# EAGLE schematic MISSION_FM1 (EAGLE 5.10)
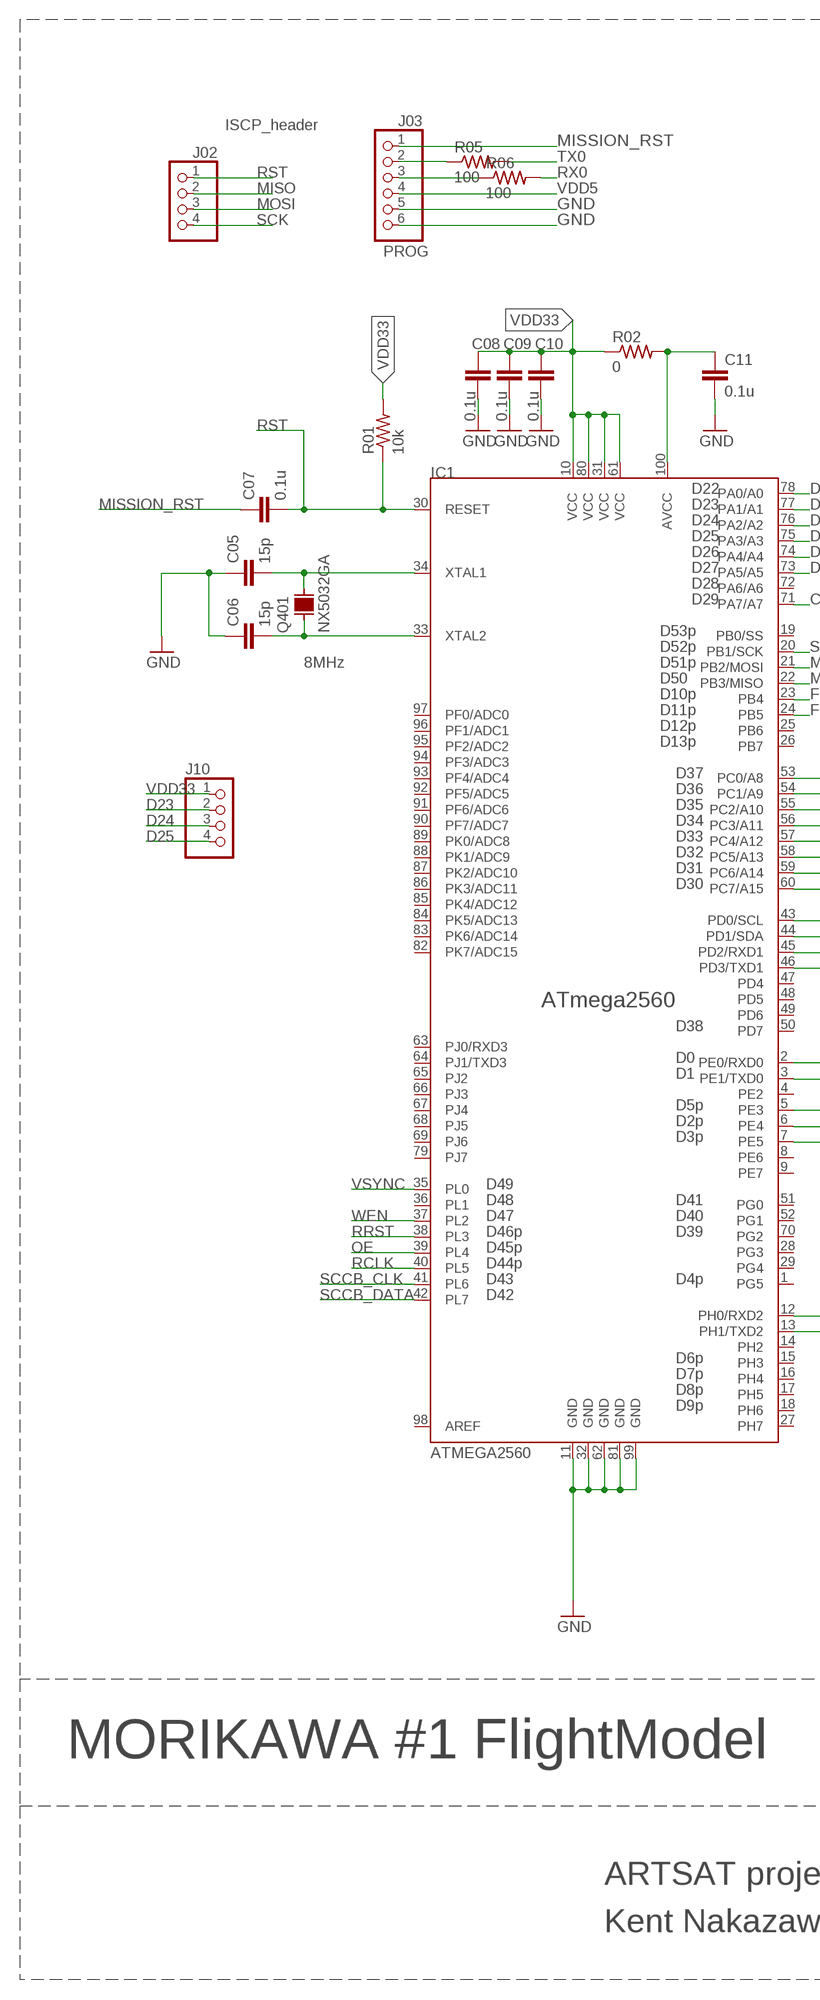
[diagram p0: schematic, sheet 1, part 1 of 2]
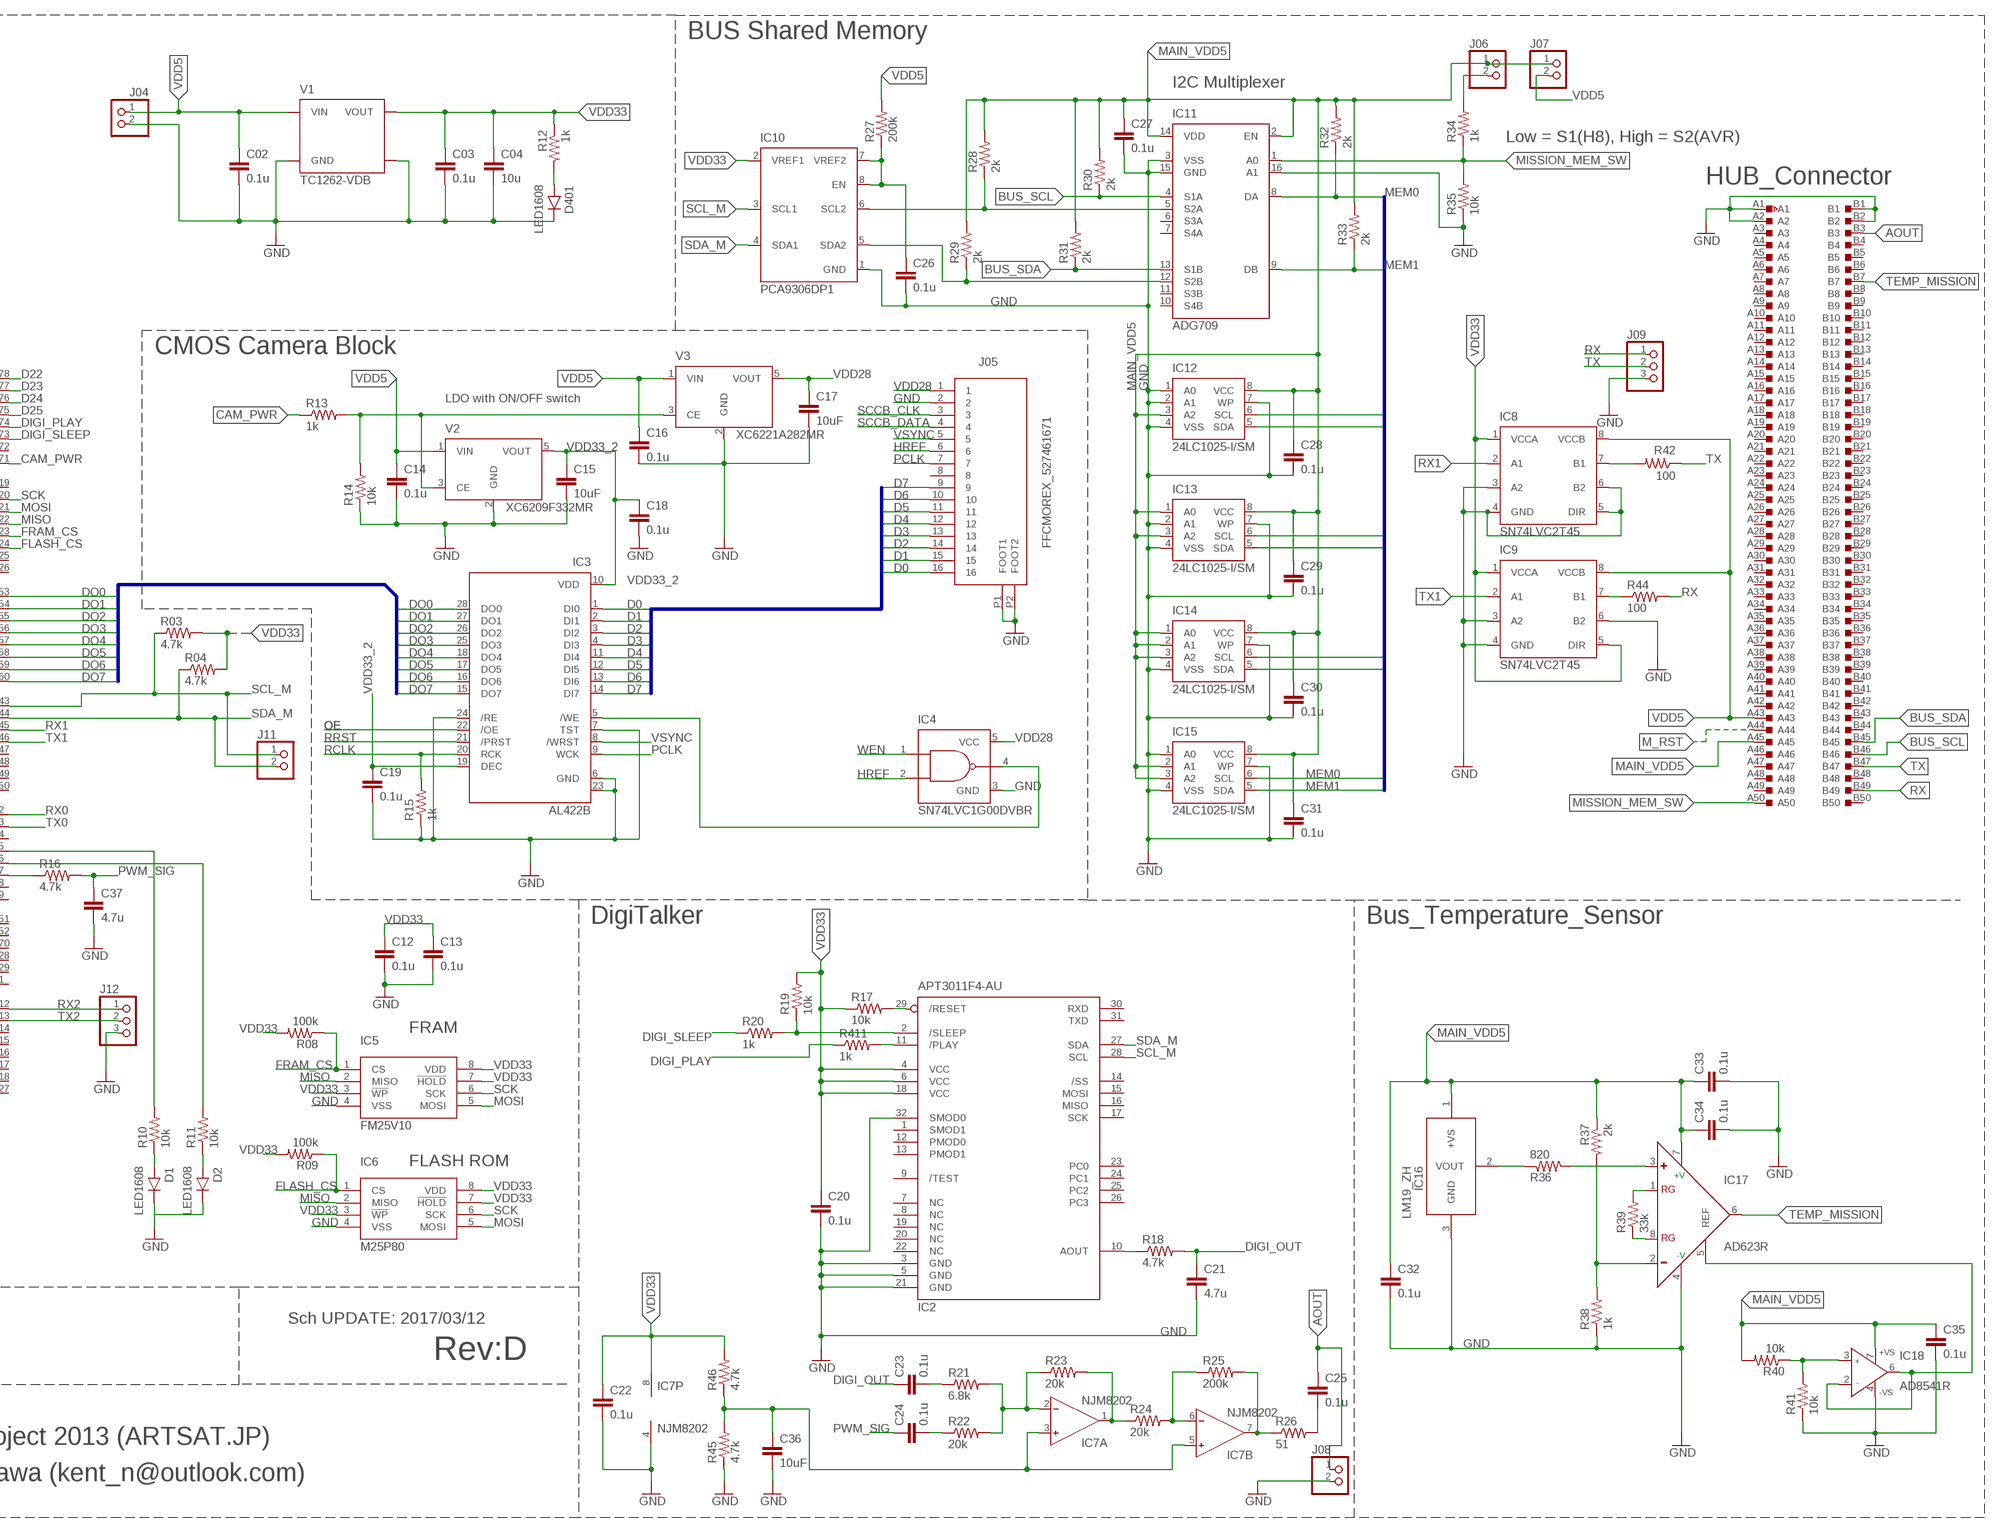
[diagram p1: schematic, sheet 1, part 2 of 2]

## Parts
C02  0.1u  C-EUC0402  [C1015(0402)]
C03  0.1u  C-EUC0402  [C1015(0402)]
C04  10u  C-EUC0805  [C2012(0805)]
C05  15p  C-EUC0402  [C1015(0402)]
C06  15p  C-EUC0402  [C1015(0402)]
C07  0.1u  C-EUC0402  [C1015(0402)]
C08  0.1u  C-EUC0402  [C1015(0402)]
C09  0.1u  C-EUC0402  [C1015(0402)]
C10  0.1u  C-EUC0402  [C1015(0402)]
C11  0.1u  C-EUC0402  [C1015(0402)]
C12  0.1u  C-EUC0402  [C1015(0402)]
C13  0.1u  C-EUC0402  [C1015(0402)]
C14  0.1u  C-EUC0402  [C1015(0402)]
C15  10uF  C-EUC0603  [C1608(0603)]
C16  0.1u  C-EUC0402  [C1015(0402)]
C17  10uF  C-EUC0603  [C1608(0603)]
C18  0.1u  C-EUC0402  [C1015(0402)]
C19  0.1u  C-EUC0402  [C1015(0402)]
C20  0.1u  C-EUC0402  [C1015(0402)]
C21  4.7u  C-EUC0402  [C1015(0402)]
C22  0.1u  C-EUC0402  [C1015(0402)]
C23  0.1u  C-EUC0402  [C1015(0402)]
C24  0.1u  C-EUC0402  [C1015(0402)]
C25  0.1u  C-EUC0402  [C1015(0402)]
C26  0.1u  C-EUC0402  [C1015(0402)]
C27  0.1u  C-EUC0402  [C1015(0402)]
C28  0.1u  C-EUC0402  [C1015(0402)]
C29  0.1u  C-EUC0402  [C1015(0402)]
C30  0.1u  C-EUC0402  [C1015(0402)]
C31  0.1u  C-EUC0402  [C1015(0402)]
C32  0.1u  C-EUC0402  [C1015(0402)]
C33  0.1u  C-EUC0402  [C1015(0402)]
C34  0.1u  C-EUC0402  [C1015(0402)]
C35  0.1u  C-EUC0402  [C1015(0402)]
C36  10uF  C-EUC0603  [C1608(0603)]
C37  4.7u  C-EUC0402  [C1015(0402)]
D1  LED1608  [LED1608]
D2  LED1608  [LED1608]
D401  LED1608  [LED1608]
IC1  ATMEGA2560  [TQFP100]
IC2  APT3011F4-AU  [TQFP32-08]
IC3  AL422B  [SOP28]
IC4  SN74LVC1G00DVBR  [SOT23-5@1]
IC5  FM25V10  [SO08]
IC6  M25P80  FM25V10  [SO08]
IC7  NJM8202  [TVSP8]
IC8  SN74LVC2T45  [PSOP8]
IC9  SN74LVC2T45  [PSOP8]
IC10  PCA9306DP1  [TSSOP8]
IC11  ADG709  [TSSOP16]
IC12  24LC1025-I/SM  [SOIC8]
IC13  24LC1025-I/SM  [SOIC8]
IC14  24LC1025-I/SM  [SOIC8]
IC15  24LC1025-I/SM  [SOIC8]
IC16  LM19_ZH  [LM19_XH]
IC17  AD623R  [SO8]
IC18  AD8541R  [SO8]
J01  XH3B-013P-D5F_NEW  [XH3B-013P-D5F]
J02  PINHD-1X4  [1X04]
J03  PINHD-1X6  [1X06]
J04  PINHD-1X2  [1X02]
J05  FFCMOREX_527461671  [MOREX_527461671]
J06  PINHD-1X2  [1X02]
J07  PINHD-1X2  [1X02]
J08  PINHD-1X2  [1X02]
J09  PINHD-1X3  [1X03]
J10  PINHD-1X4  [1X04]
J11  PINHD-1X2  [1X02]
J12  PINHD-1X3  [1X03]
Q401  NX5032GA  [NX5032GA]
R01  10k  R-US_R0402  [R1005M(0603)]
R02  0  R-US_R0402  [R1005M(0603)]
R03  4.7k  R-US_R0402  [R1005M(0603)]
R04  4.7k  R-US_R0402  [R1005M(0603)]
R05  100  R-US_R0402  [R1005M(0603)]
R06  100  R-US_R0402  [R1005M(0603)]
R08  100k  R-US_R0402  [R1005M(0603)]
R09  100k  R-US_R0402  [R1005M(0603)]
R10  10k  R-US_R0402  [R1005M(0603)]
R11  10k  R-US_R0402  [R1005M(0603)]
R12  1k  R-US_R0402  [R1005M(0603)]
R13  1k  R-US_R0402  [R1005M(0603)]
R14  10k  R-US_R0402  [R1005M(0603)]
R15  1k  R-US_R0402  [R1005M(0603)]
R16  4.7k  R-US_R0402  [R1005M(0603)]
R17  10k  R-US_R0402  [R1005M(0603)]
R18  4.7k  R-US_R0402  [R1005M(0603)]
R19  10k  R-US_R0402  [R1005M(0603)]
R20  1k  R-US_R0402  [R1005M(0603)]
R21  6.8k  R-US_R0402  [R1005M(0603)]
R22  20k  R-US_R0402  [R1005M(0603)]
R23  20k  R-US_R0402  [R1005M(0603)]
R24  20k  R-US_R0402  [R1005M(0603)]
R25  200k  R-US_R0402  [R1005M(0603)]
R26  51  R-US_R0402  [R1005M(0603)]
R27  200k  R-US_R0402  [R1005M(0603)]
R28  2k  R-US_R0402  [R1005M(0603)]
R29  2k  R-US_R0402  [R1005M(0603)]
R30  2k  R-US_R0402  [R1005M(0603)]
R31  2k  R-US_R0402  [R1005M(0603)]
R32  2k  R-US_R0402  [R1005M(0603)]
R33  2k  R-US_R0402  [R1005M(0603)]
R34  1k  R-US_R0402  [R1005M(0603)]
R35  10k  R-US_R0402  [R1005M(0603)]
R36  820  R-US_R0402  [R1005M(0603)]
R37  2k  R-US_R0402  [R1005M(0603)]
R38  1k  R-US_R0603  [R1608M(0603)]
R39  33k  R-US_R0402  [R1005M(0603)]
R40  10k  R-US_R0402  [R1005M(0603)]
R41  10k  R-US_R0402  [R1005M(0603)]
R42  100  R-US_R0402  [R1005M(0603)]
R44  100  R-US_R0402  [R1005M(0603)]
R45  4.7k  R-US_R0402  [R1005M(0603)]
R46  4.7k  R-US_R0402  [R1005M(0603)]
R411  1k  R-US_R0402  [R1005M(0603)]
V1  TC1262-VDB  [SOT-223]
V2  XC6209F332MR  [SOT-25]
V3  XC6221A282MR  [SOT-25]

## Nets
AOUT: C25.1 J01.B3 J08.1
BBBB: J03.2 R05.1
BBBBB: J03.3 R06.1
BUS_SCL: IC11.4(S1A) J01.B46 R30.1
BUS_SDA: IC11.13(S1B) J01.B45 R31.1
C4022: C06.2 IC1.33(XTAL2) Q401.1
CAM_PWR: IC1.71(PA7/A7) R13.1
D0: IC3.1(DI0) J05.16
D1: IC3.2(DI1) J05.15
D2: IC3.3(DI2) J05.14
D3: IC3.4(DI3) J05.13
D4: IC3.11(DI4) J05.12
D5: IC3.12(DI5) J05.11
D6: IC3.13(DI6) J05.10
D7: IC3.14(DI7) J05.9
D22: IC1.78(PA0/A0)
D23: IC1.77(PA1/A1) J10.2
D24: IC1.76(PA2/A2) J10.3
D25: IC1.75(PA3/A3) J10.4
DIGI_OUT: C21.1 C23.1 R18.2
DIGI_PLAY: IC1.74(PA4/A4) R411.1
DIGI_SLEEP: IC1.73(PA5/A5) R20.1
DO0: IC1.53(PC0/A8) IC3.28(DO0)
DO1: IC1.54(PC1/A9) IC3.27(DO1)
DO2: IC1.55(PC2/A10) IC3.26(DO2)
DO3: IC1.56(PC3/A11) IC3.25(DO3)
DO4: IC1.57(PC4/A12) IC3.18(DO4)
DO5: IC1.58(PC5/A13) IC3.17(DO5)
DO6: IC1.59(PC6/A14) IC3.16(DO6)
DO7: IC1.60(PC7/A15) IC3.15(DO7)
F: IC10.6(SCL2) IC11.5(S2A) R28.1
FLASH_CS: IC1.24(PB5) IC6.1(CS) R09.1
FRAM_CS: IC1.23(PB4) IC5.1(CS) R08.1
GND: C02.2 C03.2 C04.2 C05.1 C06.1 C08.2 C09.2 C10.2 C11.2 C12.2 C13.2 C14.2 C15.2 C16.2 C17.2 C18.2 C19.2 C20.2 C21.2 C22.2 C26.2 C27.2 C28.2 C29.2 C30.2 C31.2 C32.2 C33.2 C34.2 C35.2 C36.2 C37.2 D1.K D2.K D401.K IC1.11(GND) IC1.32(GND) IC1.62(GND) IC1.81(GND) IC1.99(GND) IC2.3(GND) IC2.5(GND) IC2.21(GND) IC2.32(SMOD0) IC3.6(GND) IC3.7(TST) IC3.23 IC3.24(/RE) IC4.3(GND) IC5.4(VSS) IC6.4(VSS) IC7.4(P:V-) IC8.3(A2) IC8.4(GND) IC8.5(DIR) IC8.6(B2) IC9.3(A2) IC9.4(GND) IC9.6(B2) IC10.1(GND) IC11.3(VSS) IC11.15(GND) IC11.16(A1) IC12.1(A0) IC12.2(A1) IC12.4(VSS) IC12.7(WP) IC13.2(A1) IC13.4(VSS) IC13.7(WP) IC14.4(VSS) IC14.7(WP) IC15.1(A0) IC15.4(VSS) IC15.7(WP) IC16.3(GND) IC17.4(-V) IC18.4(-VS) J01.A1 J01.A2 J01.B1 J01.B2 J03.5 J03.6 J04.2 J05.2 J05.P1(FOOT1) J05.P2(FOOT2) J08.2 J09.3 J12.3 R14.1 R15.1 R35.1 R38.1 R41.1 R45.1 V1.2(GND) V1.4 V2.2(GND) V3.2(GND)
HREF: IC4.2(B) J05.6
LED2: IC1.5(PE3) R10.2
LED3: IC1.6(PE4) R11.2
M_RST: J01.A44
MAIN_VDD5: C27.1 C28.1 C29.1 C30.1 C31.1 C32.1 C33.1 C34.1 C35.1 IC11.2(EN) IC11.14(VDD) IC12.3(A2) IC12.8(VCC) IC13.1(A0) IC13.3(A2) IC13.8(VCC) IC14.1(A0) IC14.2(A1) IC14.3(A2) IC14.8(VCC) IC15.2(A1) IC15.3(A2) IC15.8(VCC) IC16.1(+VS) IC17.7(+V) IC18.7(+VS) J01.A45 J06.1 J07.1 R28.2 R29.2 R30.2 R31.2 R32.2 R33.2 R37.1 R40.2
MEM0: IC11.8(DA) IC12.6(SCL) IC13.6(SCL) IC14.6(SCL) IC15.6(SCL) R32.1
MEM1: IC11.9(DB) IC12.5(SDA) IC13.5(SDA) IC14.5(SDA) IC15.5(SDA) R33.1
MISO: IC1.22(PB3/MISO) IC5.2(MISO) IC6.2(MISO) J02.2
MISSION_MEM_SW: IC11.1(A0) J01.A50 R34.1 R35.2
MISSION_RST: C07.1 J03.1
MOSI: IC1.21(PB2/MOSI) IC5.5(MOSI) IC6.5(MOSI) J02.3
N$1: C11.1 IC1.100(AVCC) R02.2
N$2: J06.2 R34.2
N$3: C05.2 IC1.34(XTAL1) Q401.2
N$4: IC3.5(/WE) IC4.4(Y)
N$5: R13.2 R14.2 V2.3(CE) V3.3(CE)
N$6: IC17.5(REF) IC18.2(IN-) IC18.6(OUT)
N$7: IC2.10(AOUT) R18.1
N$8: IC2.2(/SLEEP) R19.1 R20.2
N$9: IC7.1(A:OUT) R23.2 R24.1
N$10: IC16.2(VOUT) R36.1
N$11: IC17.8(RG) R39.1
N$12: D1.A R10.1
N$13: C25.2 R26.2
N$14: IC17.1(RG) R39.2
N$15: IC18.3(IN+) R40.1 R41.2
N$16: IC17.3(+) R36.2
N$17: IC2.11(/PLAY) R411.2
N$18: D2.A R11.1
N$19: IC7.6(B:IN-) R24.2 R25.1
N$20: IC7.2(A:IN-) R21.2 R22.2 R23.1
N$21: IC10.5(SDA2) IC11.12(S2B) R29.1
N$22: IC17.2(-) R37.2 R38.2
N$23: D401.A R12.2
N$24: IC8.7(B1) R42.2
N$25: IC7.7(B:OUT) R25.2 R26.1
N$26: C23.2 R21.1
N$27: C24.2 R22.1
N$28: IC2.29(/RESET) R17.2
N$29: IC9.7(B1) R44.1
N$33: C26.1 IC10.7(VREF2) IC10.8(EN) R27.1
OE: IC1.39(PL4) IC3.22(/OE)
OP_BIAS: C36.1 IC7.3(A:IN+) IC7.5(B:IN+) R45.2 R46.1
PCLK: IC3.9(WCK) J05.7
PWM_OUT: IC1.7(PE5) R16.1
PWM_SIG: C24.1 C37.1 R16.2
RCLK: IC1.40(PL5) IC3.20(RCK) R15.2
RRST: IC1.38(PL3) IC3.21(/PRST)
RST: C07.2 IC1.30(RESET) J02.1 R01.1
RX: J01.B49 J09.1 R44.2
RX0: IC1.2(PE0/RXD0) R06.2
RX1: IC1.45(PD2/RXD1) IC8.2(A1)
RX2: IC1.12(PH0/RXD2) J12.1
SCCB_CLK: IC1.41(PL6) J05.3
SCCB_DATA: IC1.42(PL7) J05.4
SCK: IC1.20(PB1/SCK) IC5.6(SCK) IC6.6(SCK) J02.4
SCL_M: IC1.43(PD0/SCL) IC2.28(SCL) IC10.3(SCL1) J11.1 R03.1
SDA_M: IC1.44(PD1/SDA) IC2.27(SDA) IC10.4(SDA1) J11.2 R04.1
TEMP_MISSION: IC17.6(OUT) J01.B7
TX: J01.B47 J09.2 R42.1
TX0: IC1.3(PE1/TXD0) R05.2
TX1: IC1.46(PD3/TXD1) IC9.2(A1)
TX2: IC1.13(PH1/TXD2) J12.2
VDD5: C02.1 C14.1 C16.1 IC8.8(VCCB) IC9.8(VCCB) J01.A43 J03.4 J04.1 J07.2 R27.2 V1.1(VIN) V2.1(VIN) V3.1(VIN)
VDD28: C17.1 IC4.5(VCC) J05.1 V3.5(VOUT)
VDD33: C03.1 C04.1 C08.1 C09.1 C10.1 C12.1 C13.1 C20.1 C22.1 IC1.10(VCC) IC1.31(VCC) IC1.61(VCC) IC1.80(VCC) IC2.4(VCC) IC2.6(VCC) IC2.18(VCC) IC5.3(!WP) IC5.7(!HOLD) IC5.8(VDD) IC6.3(!WP) IC6.7(!HOLD) IC6.8(VDD) IC7.8(P:V+) IC8.1(VCCA) IC9.1(VCCA) IC9.5(DIR) IC10.2(VREF1) J10.1 R01.2 R02.1 R03.2 R04.2 R08.2 R09.2 R12.1 R17.1 R19.2 R46.2 V1.3(VOUT)
VDD33_2: C15.1 C18.1 C19.1 IC3.10(VDD) IC3.19(DEC) V2.5(VOUT)
VSYNC: IC1.35(PL0) IC3.8(/WRST) J05.5
WEN: IC1.37(PL2) IC4.1(A)
Unconnected: IC1.1(PG5) IC1.4(PE2) IC1.8(PE6) IC1.9(PE7) IC1.14(PH2) IC1.15(PH3) IC1.16(PH4) IC1.17(PH5) IC1.18(PH6) IC1.19(PB0/SS) IC1.25(PB6) IC1.26(PB7) IC1.27(PH7) IC1.28(PG3) IC1.29(PG4) IC1.36(PL1) IC1.47(PD4) IC1.48(PD5) IC1.49(PD6) IC1.50(PD7) IC1.51(PG0) IC1.52(PG1) IC1.63(PJ0/RXD3) IC1.64(PJ1/TXD3) IC1.65(PJ2) IC1.66(PJ3) IC1.67(PJ4) IC1.68(PJ5) IC1.69(PJ6) IC1.70(PG2) IC1.72(PA6/A6) IC1.79(PJ7) IC1.82(PK7/ADC15) IC1.83(PK6/ADC14) IC1.84(PK5/ADC13) IC1.85(PK4/ADC12) IC1.86(PK3/ADC11) IC1.87(PK2/ADC10) IC1.88(PK1/ADC9) IC1.89(PK0/ADC8) IC1.90(PF7/ADC7) IC1.91(PF6/ADC6) IC1.92(PF5/ADC5) IC1.93(PF4/ADC4) IC1.94(PF3/ADC3) IC1.95(PF2/ADC2) IC1.96(PF1/ADC1) IC1.97(PF0/ADC0) IC1.98(AREF) IC2.1(SMOD1) IC2.7(NC) IC2.8(NC) IC2.9(/TEST) IC2.12(PMOD0) IC2.13(PMOD1) IC2.14(/SS) IC2.15(MOSI) IC2.16(MISO) IC2.17(SCK) IC2.19(NC) IC2.20(NC) IC2.22(NC) IC2.23(PC0) IC2.24(PC1) IC2.25(PC2) IC2.26(PC3) IC2.30(RXD) IC2.31(TXD) IC11.6(S3A) IC11.7(S4A) IC11.10(S4B) IC11.11(S3B) J01.A3 J01.A4 J01.A5 J01.A6 J01.A7 J01.A8 J01.A9 J01.A10 J01.A11 J01.A12 J01.A13 J01.A14 J01.A15 J01.A16 J01.A17 J01.A18 J01.A19 J01.A20 J01.A21 J01.A22 J01.A23 J01.A24 J01.A25 J01.A26 J01.A27 J01.A28 J01.A29 J01.A30 J01.A31 J01.A32 J01.A33 J01.A34 J01.A35 J01.A36 J01.A37 J01.A38 J01.A39 J01.A40 J01.A41 J01.A42 J01.A46 J01.A47 J01.A48 J01.A49 J01.B4 J01.B5 J01.B6 J01.B8 J01.B9 J01.B10 J01.B11 J01.B12 J01.B13 J01.B14 J01.B15 J01.B16 J01.B17 J01.B18 J01.B19 J01.B20 J01.B21 J01.B22 J01.B23 J01.B24 J01.B25 J01.B26 J01.B27 J01.B28 J01.B29 J01.B30 J01.B31 J01.B32 J01.B33 J01.B34 J01.B35 J01.B36 J01.B37 J01.B38 J01.B39 J01.B40 J01.B41 J01.B42 J01.B43 J01.B44 J01.B48 J01.B50 J05.8

## Buses
D[0..7]
DO[0..7]
MEM[0..1]

## Notes on the sheet
- BUS Shared Memory
- I2C Multiplexer
- ISCP_header
- Low = S1(H8), High = S2(AVR)
- HUB_Connector
- PROG
- CMOS Camera Block
- D22
- D23
- D24 | LDO with ON/OFF switch
- D25
- D26
- D27
- D28
- D29
- D53p
- D52p
- 8MHz | D51p
- D50
- D10p
- D11p
- D12p
- D13p
- D37
- D36
- D35
- D34
- D33
- D32
- D31
- D30
- ATmega2560
- D38
- D0
- D1
- D5p
- D2p
- D3p
- D49
- D48 | D41 | DigiTalker | Bus_Temperature_Sensor
- D47 | D40
- D46p | D39
- D45p
- D44p
- D43 | D4p
- D42
- FRAM
- D6p
- D7p
- D8p
- D9p
- FLASH ROM
- Sch UPDATE: 2017/03/12
- MORIKAWA #1 FlightModel
- Rev:D
- ARTSAT project 2013 (ARTSAT.JP)
- Kent Nakazawa (kent_n@outlook.com)

## Library data of the parts
C02-C09 C10-C37 = capacitor:C-EU: CAPACITOR, European symbol
D1 D2 D401 = IC:LED1608: OSB1608 Chip LED 1608(JIS)
IC1 = IC:ATMEGA2560: ATmega1280/2560 TQFP100 ATmega1280
IC2 = IC:APT3011F4: AquesTalk pico ATP3011F4-AU Japanese voice synthesis midleware on Atmega328p-AU
IC3 = IC:AL422B: AL422B FIFO AVERLOGIC 3M-Bit Frame Buffer
IC4 = IC:SN74LVC1G00: SN74LVC1G00 TI SINGLE 2-INPUT POSITIVE-NAND GATE
IC5 IC6 = IC:FM25V10: SPI FRAM Cypress http://www.digikey.jp/product-detail/ja/FM25VN10-GTR/1140-1029-1-ND/2917720
IC7 = OPamp:NJM8202: 10 MHz full-swing Operational Amplifier http://akizukidenshi.com/catalog/g/gI-04724/
IC8 IC9 = IC:SN74LVC2T45: SN74LVC2T45 TI DUAL-BIT DUAL-SUPPLY BUS TRANSCEIVER
IC10 = IC:PCA9306: PCA9306 NXP Dual bidirectional I2C-bus and SMBus voltage-level translator
IC11 = IC:ADG709: ADG709 ANALOG DEVICES 4-/8-Channel Multiplexers Differential 4-to-1 multiplexer 16-lead TSSOP package 1.8 V to 5.5 V single supply ±2.5 V dual supply 3 ? on resistance 0.75 ? on resistance flatness 100 pA leakage currents 14 ns switching times
IC12-IC15 = IC:24LC1025: 24LC1025 I2C EEPROM 24LC1025/24FC1025 1024k I2C Serial EEPROM 24LC1025-I/P: Industrial Temperature, PDIP package. 24LC1025-E/SM: Extended Temperature, SOIJ package. 24LC1025T-I/SM: Tape and Reel, Industrial Temperature, SOIJ package.
IC16 = LM19_ZH:LM19_ZH: LM19 + Connector(JST XH)
IC17 = IC:AD623: Single-Supply, Rail-to-Rail, Low Cost Instrumentation Amplifier Source: http://www.analog.com/static/imported-files/data_sheets/AD623.pdf; MPN: AD623ARZ.; OC_FARNELL: 9426213; OC_NEWARK: 31M4186
IC18 = IC:AD8541: General-Purpose CMOS Rail-to-Rail Amplifiers Source: http://www.analog.com/static/imported-files/data_sheets/AD8541_8542_8544.pdf; MPN: AD8541ARZ; OC_FARNELL: 9603859; OC_NEWARK: 31M4547
J01 = habconector20120702:XH3B-013P-D5F_NEW: OMRON HabConnector XH3B-013P-D5F 2012-07-02
J02 J10 = PINHEAD_round_254:PINHD-1X4: PIN HEADER
J03 = PINHEAD_round_254:PINHD-1X6: PIN HEADER
J04 J06-J08 J11 = PINHEAD_round_254:PINHD-1X2: PIN HEADER
J05 = FPC:FFCMOREX_527461671
J09 J12 = PINHEAD_round_254:PINHD-1X3: PIN HEADER
Q401 = IC:NX5032GA: NX5032CA Nihon Denpa Kogyo Crystal SMD
R01-R06 R08 R09 R10-R42 R44-R46 R411 = Resistor:R-US_: RESISTOR, American symbol
V1 = IC:TC1262: 500mA Fixed Output CMOS LDO
V2 = IC:XC6209F332MR: XC6209/XC6212Series High Speed LDO Regulators Low ESR Cap.Compatible,Output ON/OFFControl
V3 = IC:XC6221A282MR: XC6221 LDO Voltage Regulator with ON/OFF switch LDO Voltage Regulator with ON/OFF switch TOREX semiconductor